# EAGLE schematic triple8 (EAGLE 5.06)
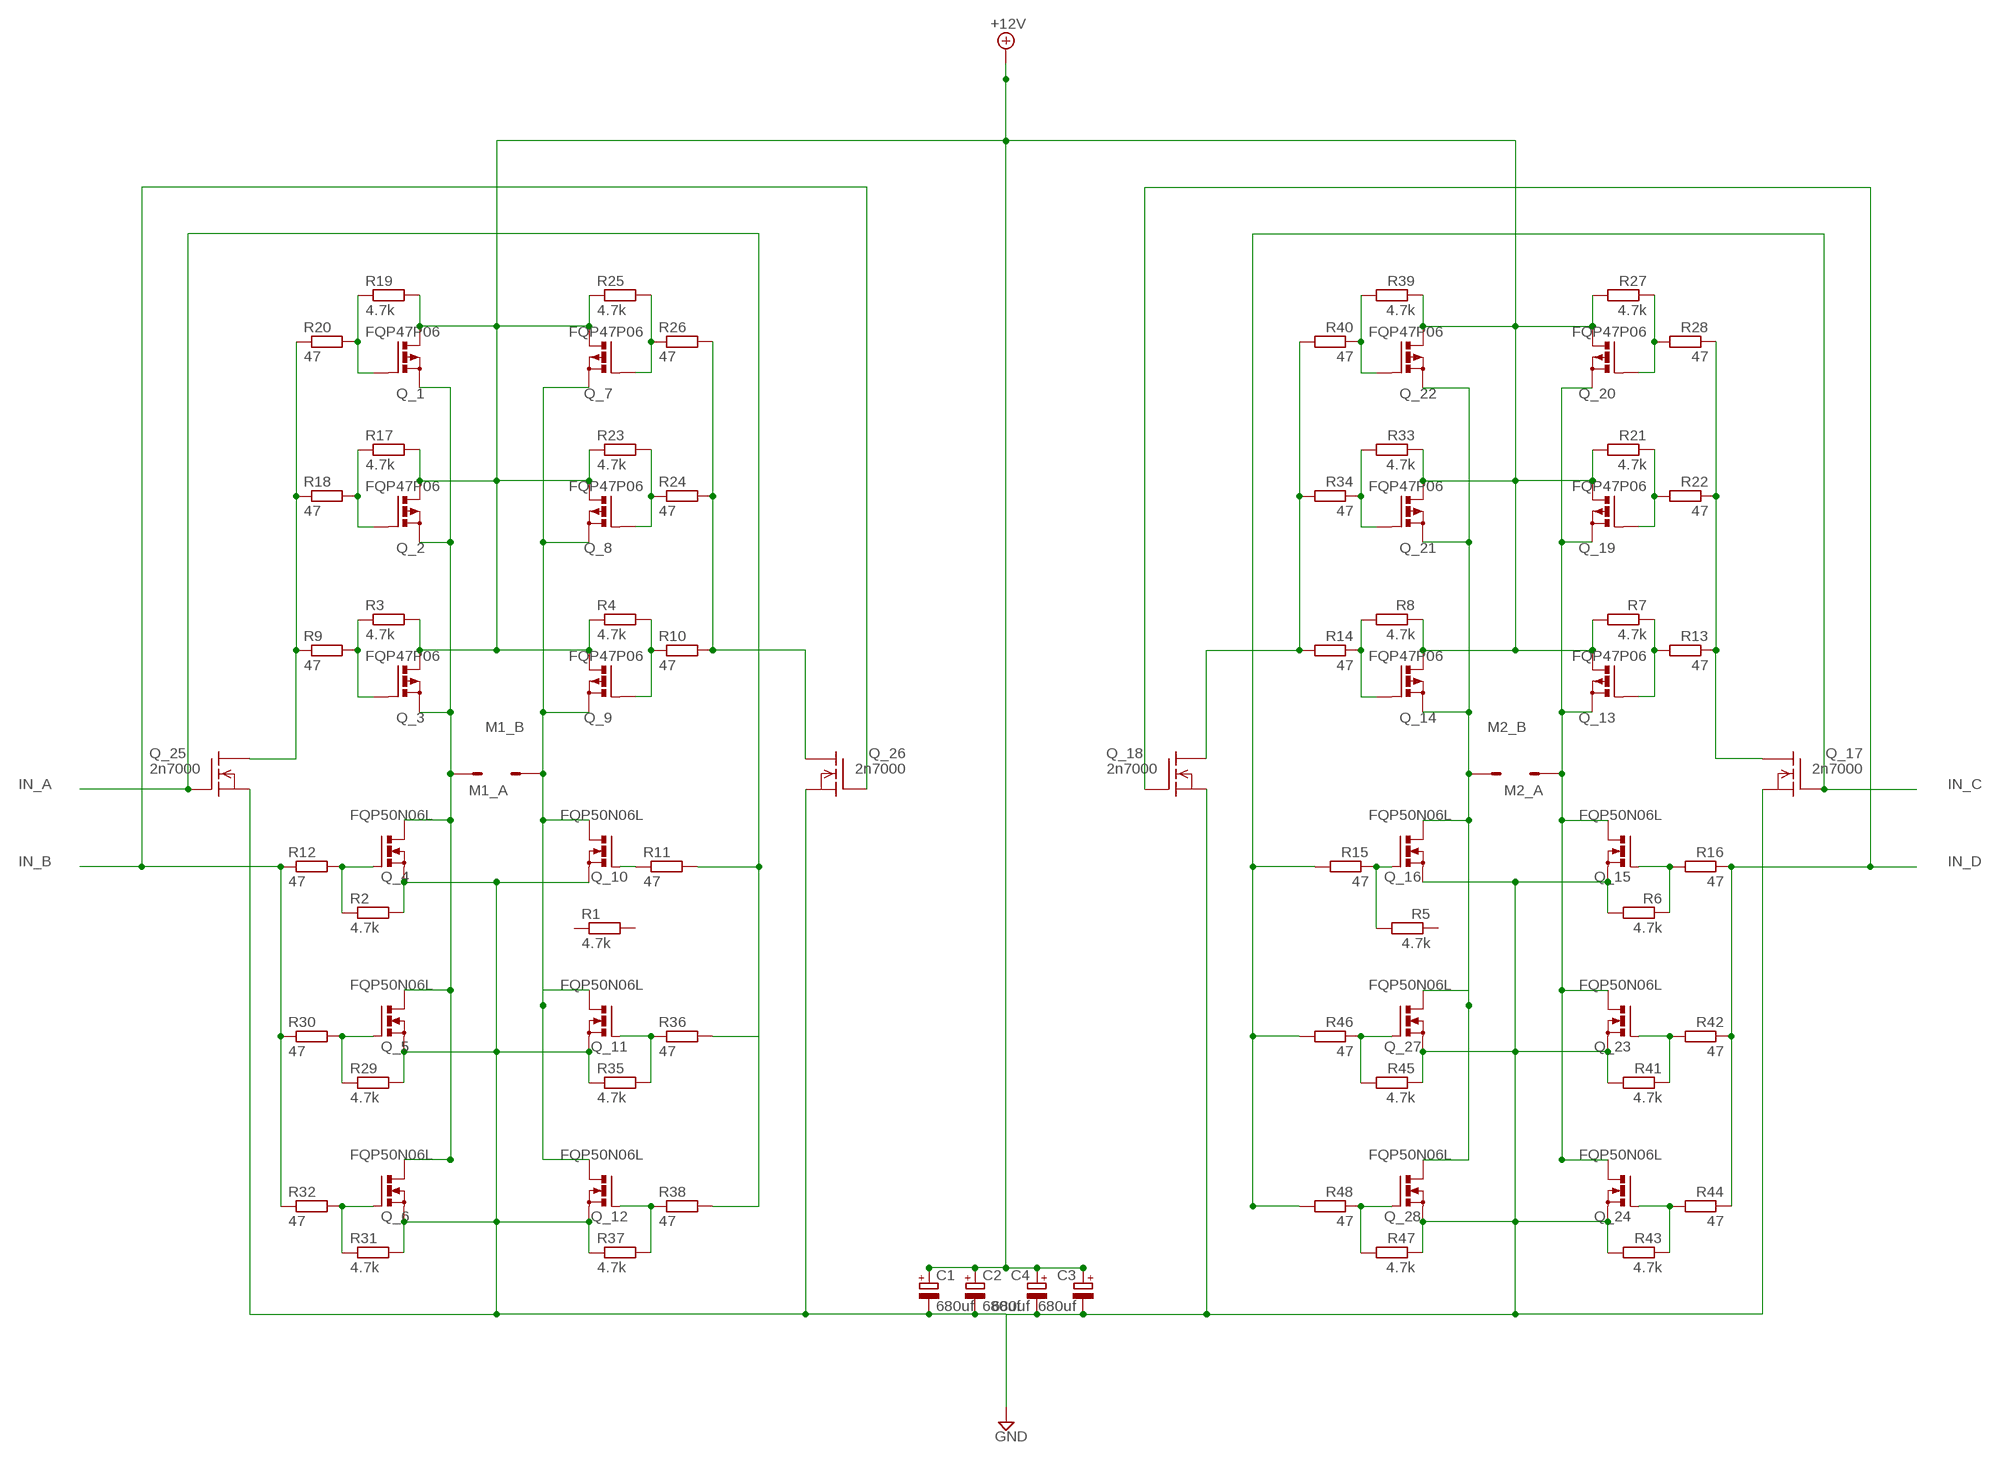
[diagram p0: schematic, sheet 1]

## Parts
C1  680uf  CPOL-EUE5-13  [E5-13]
C2  680uf  CPOL-EUE5-13  [E5-13]
C3  680uf  CPOL-EUE5-13  [E5-13]
C4  680uf  CPOL-EUE5-13  [E5-13]
M1_A  ST2,8  [ST2,8]
M1_B  ST2,8  [ST2,8]
M2_A  ST2,8  [ST2,8]
M2_B  ST2,8  [ST2,8]
Q_1  FQP47P06  PMOSFET_PTO220BV  [TO220BV]
Q_2  FQP47P06  PMOSFET_PTO220BV  [TO220BV]
Q_3  FQP47P06  PMOSFET_PTO220BV  [TO220BV]
Q_4  FQP50N06L  PMOSFET_NTO220BV  [TO220BV]
Q_5  FQP50N06L  PMOSFET_NTO220BV  [TO220BV]
Q_6  FQP50N06L  PMOSFET_NTO220BV  [TO220BV]
Q_7  FQP47P06  PMOSFET_PTO220BV  [TO220BV]
Q_8  FQP47P06  PMOSFET_PTO220BV  [TO220BV]
Q_9  FQP47P06  PMOSFET_PTO220BV  [TO220BV]
Q_10  FQP50N06L  PMOSFET_NTO220BV  [TO220BV]
Q_11  FQP50N06L  PMOSFET_NTO220BV  [TO220BV]
Q_12  FQP50N06L  PMOSFET_NTO220BV  [TO220BV]
Q_13  FQP47P06  PMOSFET_PTO220BV  [TO220BV]
Q_14  FQP47P06  PMOSFET_PTO220BV  [TO220BV]
Q_15  FQP50N06L  PMOSFET_NTO220BV  [TO220BV]
Q_16  FQP50N06L  PMOSFET_NTO220BV  [TO220BV]
Q_17  2n7000  BSS101  [TO92]
Q_18  2n7000  BSS101  [TO92]
Q_19  FQP47P06  PMOSFET_PTO220BV  [TO220BV]
Q_20  FQP47P06  PMOSFET_PTO220BV  [TO220BV]
Q_21  FQP47P06  PMOSFET_PTO220BV  [TO220BV]
Q_22  FQP47P06  PMOSFET_PTO220BV  [TO220BV]
Q_23  FQP50N06L  PMOSFET_NTO220BV  [TO220BV]
Q_24  FQP50N06L  PMOSFET_NTO220BV  [TO220BV]
Q_25  2n7000  BSS101  [TO92]
Q_26  2n7000  BSS101  [TO92]
Q_27  FQP50N06L  PMOSFET_NTO220BV  [TO220BV]
Q_28  FQP50N06L  PMOSFET_NTO220BV  [TO220BV]
R1  4.7k  R-EU_0204/5  [0204/5]
R2  4.7k  R-EU_0204/5  [0204/5]
R3  4.7k  R-EU_0204/5  [0204/5]
R4  4.7k  R-EU_0204/5  [0204/5]
R5  4.7k  R-EU_0204/5  [0204/5]
R6  4.7k  R-EU_0204/5  [0204/5]
R7  4.7k  R-EU_0204/5  [0204/5]
R8  4.7k  R-EU_0204/5  [0204/5]
R9  47  R-EU_0204/5  [0204/5]
R10  47  R-EU_0204/5  [0204/5]
R11  47  R-EU_0204/5  [0204/5]
R12  47  R-EU_0204/5  [0204/5]
R13  47  R-EU_0204/5  [0204/5]
R14  47  R-EU_0204/5  [0204/5]
R15  47  R-EU_0204/5  [0204/5]
R16  47  R-EU_0204/5  [0204/5]
R17  4.7k  R-EU_0204/5  [0204/5]
R18  47  R-EU_0204/5  [0204/5]
R19  4.7k  R-EU_0204/5  [0204/5]
R20  47  R-EU_0204/5  [0204/5]
R21  4.7k  R-EU_0204/5  [0204/5]
R22  47  R-EU_0204/5  [0204/5]
R23  4.7k  R-EU_0204/5  [0204/5]
R24  47  R-EU_0204/5  [0204/5]
R25  4.7k  R-EU_0204/5  [0204/5]
R26  47  R-EU_0204/5  [0204/5]
R27  4.7k  R-EU_0204/5  [0204/5]
R28  47  R-EU_0204/5  [0204/5]
R29  4.7k  R-EU_0204/5  [0204/5]
R30  47  R-EU_0204/5  [0204/5]
R31  4.7k  R-EU_0204/5  [0204/5]
R32  47  R-EU_0204/5  [0204/5]
R33  4.7k  R-EU_0204/5  [0204/5]
R34  47  R-EU_0204/5  [0204/5]
R35  4.7k  R-EU_0204/5  [0204/5]
R36  47  R-EU_0204/5  [0204/5]
R37  4.7k  R-EU_0204/5  [0204/5]
R38  47  R-EU_0204/5  [0204/5]
R39  4.7k  R-EU_0204/5  [0204/5]
R40  47  R-EU_0204/5  [0204/5]
R41  4.7k  R-EU_0204/5  [0204/5]
R42  47  R-EU_0204/5  [0204/5]
R43  4.7k  R-EU_0204/5  [0204/5]
R44  47  R-EU_0204/5  [0204/5]
R45  4.7k  R-EU_0204/5  [0204/5]
R46  47  R-EU_0204/5  [0204/5]
R47  4.7k  R-EU_0204/5  [0204/5]
R48  47  R-EU_0204/5  [0204/5]

## Nets
+12V: C1.+ C2.+ Q_1.S(D) Q_2.S(D) Q_3.S(D) Q_7.S(D) Q_8.S(D) Q_9.S(D) Q_13.S(D) Q_14.S(D) Q_19.S(D) Q_20.S(D) Q_21.S(D) Q_22.S(D) R3.2 R4.1 R7.2 R8.1 R17.2 R19.2 R21.2 R23.1 R25.1 R27.2 R33.1 R39.1
GND: C1.- C2.- C3.- C4.- Q_4.S Q_5.S Q_6.S Q_10.S Q_11.S Q_12.S Q_15.S Q_16.S Q_17.1(S) Q_18.1(S) Q_23.S Q_24.S Q_25.1(S) Q_26.1(S) Q_27.S Q_28.S R2.2 R6.2 R29.2 R31.2 R35.1 R37.1 R41.2 R43.2 R45.1 R47.1
IN_A: Q_25.2(G) R11.2 R36.2 R38.2
IN_B: Q_26.2(G) R12.1 R30.1 R32.1
IN_C: Q_17.2(G) R15.2 R46.2 R48.2
IN_D: Q_18.2(G) R16.1 R42.1 R44.1
M1_A: M1_A.1(ST) Q_1.D(S) Q_2.D(S) Q_3.D(S) Q_4.D Q_5.D Q_6.D
M1_A1: M2_A.1(ST) Q_13.D(S) Q_15.D Q_19.D(S) Q_20.D(S) Q_23.D Q_24.D
M1_B: M1_B.1(ST) Q_7.D(S) Q_8.D(S) Q_9.D(S) Q_10.D Q_11.D Q_12.D
M1_B1: M2_B.1(ST) Q_14.D(S) Q_16.D Q_21.D(S) Q_22.D(S) Q_27.D Q_28.D
N$1: Q_5.G R29.1 R30.2
N$2: Q_14.G R8.2 R14.1
N$3: Q_4.G R2.1 R12.2
N$4: Q_10.G R11.1
N$5: Q_13.G R7.1 R13.2
N$6: Q_2.G R17.1 R18.2
N$7: Q_15.G R6.1 R16.2
N$8: Q_25.3(D) R9.1 R18.1 R20.1
N$9: Q_16.G R5.2 R15.1
N$10: Q_3.G R3.1 R9.2
N$11: Q_9.G R4.2 R10.1
N$12: Q_19.G R21.1 R22.2
N$13: Q_20.G R27.1 R28.2
N$14: Q_17.3(D) R13.1 R22.1 R28.1
N$15: Q_21.G R33.2 R34.1
N$16: Q_22.G R39.2 R40.1
N$17: Q_18.3(D) R14.2 R34.2 R40.2
N$18: Q_6.G R31.1 R32.2
N$19: Q_23.G R41.1 R42.2
N$20: Q_1.G R19.1 R20.2
N$21: Q_24.G R43.1 R44.2
N$22: Q_8.G R23.2 R24.1
N$23: Q_27.G R45.2 R46.1
N$24: Q_11.G R35.2 R36.1
N$25: Q_7.G R25.2 R26.1
N$26: Q_28.G R47.2 R48.1
N$27: C3.+ C4.+
N$29: Q_26.3(D) R10.2 R24.2 R26.2
N$31: Q_12.G R37.2 R38.1
Unconnected: R1.1 R1.2 R5.1

## Library data of the parts
C1-C4 = rcl:CPOL-EU: POLARIZED CAPACITOR, European symbol
M1_A M1_B M2_A M2_B = con-rib:ST2,8: RIBBON CABLE CONNECTOR Flachstecker / Faston
Q_1-Q_3 Q_7-Q_9 Q_13 Q_14 Q_19-Q_22 = transistor-power2:PMOSFET_P: Power MOSFET P-Channel
Q_4-Q_6 Q_10-Q_12 Q_15 Q_16 Q_23 Q_24 Q_27 Q_28 = transistor-power2:PMOSFET_N: Power MOSFET N-Channel
Q_17 Q_18 Q_25 Q_26 = transistor-fet:BSS101: N-Channel Enhancement MOSFET 200V; 0,16A; 11Ohm
R1-R48 = rcl:R-EU_: RESISTOR, European symbol